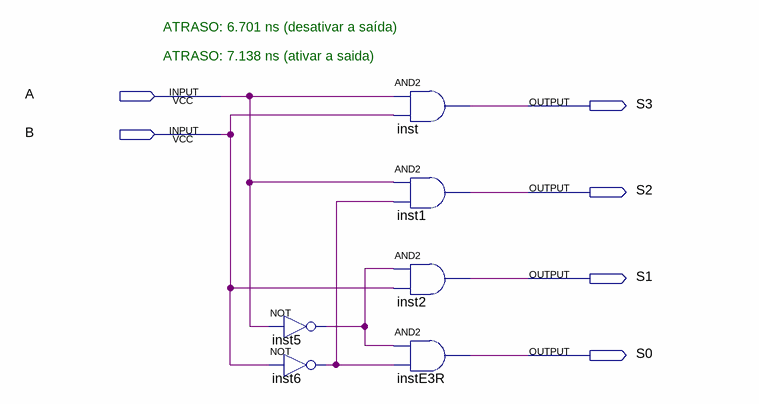
[diagram p0: schematic sheet]
// Quartus schematic decoder2_4.bdf as structural Verilog: 6 symbols, 6 pins
module decoder2_4 (
  input  A,
  input  B,
  output S3,
  output S2,
  output S1,
  output S0
);

  wire inst5_out, inst6_out;

  not inst5 (inst5_out, A);
  not inst6 (inst6_out, B);
  and inst (S3, A, B);
  and inst1 (S2, A, inst6_out);
  and inst2 (S1, inst5_out, B);
  and instE3R (S0, inst5_out, inst6_out);

  // Notes on the sheet:
  //   ATRASO: 6.701 ns (desativar a saída)
  //   ATRASO: 7.138 ns (ativar a saida)
endmodule
